# Altium schematic sheet STM32_Plate.SchDoc
size A4; PageSetup: Record=PageOptions|CenterHorizontal=True|CenterVertical=True|PrintScale=1.00|XCorrection=1.00|YCorrection=1.00|PrintKind=1|BorderSize=5000000|LeftOffset=0|BottomOffset=0|Orientation=2|PaperLength=1000|PaperWidth=1000|Scale=100|PaperSource=7|PrintQuality=-3|MediaType=1|DitherType=10|PrintScaleMode=1|PaperKind=A4|PaperIndex=9
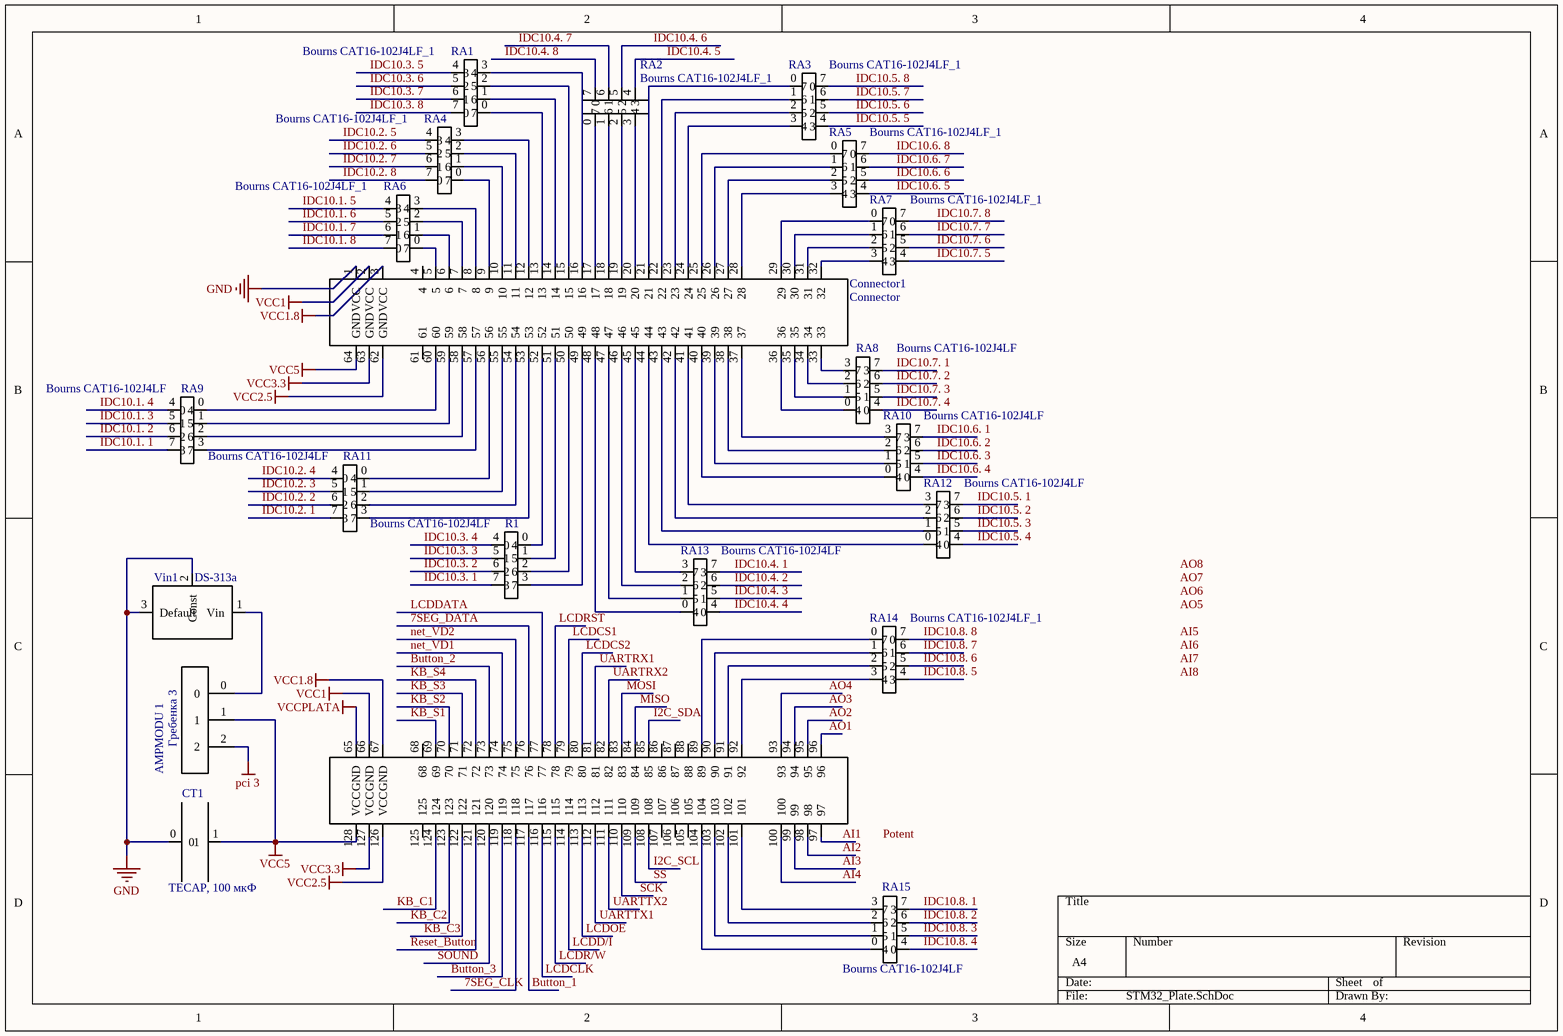
[diagram p0: STM32_Plate.SchDoc]

## Parts
AMPMODU_1  Гребенка 3  [AMPMODU 826629-3]
Connector1  Connector  [Connect]
CT1  TECAP, 100 мкФ  [tantal cap]
R1  Bourns CAT16-102J4LF  [CAT16-102J4LF]
RA1  Bourns CAT16-102J4LF_1  [CAT16-102J4LF_2]
RA2  Bourns CAT16-102J4LF_1  [CAT16-102J4LF_2]
RA3  Bourns CAT16-102J4LF_1  [CAT16-102J4LF_2]
RA4  Bourns CAT16-102J4LF_1  [CAT16-102J4LF_2]
RA5  Bourns CAT16-102J4LF_1  [CAT16-102J4LF_2]
RA6  Bourns CAT16-102J4LF_1  [CAT16-102J4LF_2]
RA7  Bourns CAT16-102J4LF_1  [CAT16-102J4LF_2]
RA8  Bourns CAT16-102J4LF  [CAT16-102J4LF]
RA9  Bourns CAT16-102J4LF  [CAT16-102J4LF]
RA10  Bourns CAT16-102J4LF  [CAT16-102J4LF]
RA11  Bourns CAT16-102J4LF  [CAT16-102J4LF]
RA12  Bourns CAT16-102J4LF  [CAT16-102J4LF]
RA13  Bourns CAT16-102J4LF  [CAT16-102J4LF]
RA14  Bourns CAT16-102J4LF_1  [CAT16-102J4LF_2]
RA15  Bourns CAT16-102J4LF  [CAT16-102J4LF]
Vin1  DS-313a  [ds-313]

## Nets
GND: Connector1.1(VCC) CT1.0 Vin1.2(Const) Vin1.3(Default)
pci 3: AMPMODU_1.2
VCC1: Connector1.2(VCC) Connector1.66(GND)
VCC1.8: Connector1.3(VCC) Connector1.67(GND)
VCC2.5: Connector1.62(GND) Connector1.126(VCC)
VCC3.3: Connector1.63(GND) Connector1.127(VCC)
VCC5: AMPMODU_1.1 Connector1.64(GND) Connector1.128(VCC) CT1.1
VCCPLATA: Connector1.65(GND)
7SEG_CLK: Connector1.118
7SEG_DATA: Connector1.76
AI1: Connector1.97
AI2: Connector1.98
AI3: Connector1.99
AI4: Connector1.100
AO1: Connector1.96
AO2: Connector1.95
AO3: Connector1.94
AO4: Connector1.93
Button_1: Connector1.117
Button_2: Connector1.73
Button_3: Connector1.119
I2C_SCL: Connector1.108
I2C_SDA: Connector1.85
IDC10.1. 1: RA9.7
IDC10.1. 2: RA9.6
IDC10.1. 3: RA9.5
IDC10.1. 4: RA9.4
IDC10.1. 5: RA6.4
IDC10.1. 6: RA6.5
IDC10.1. 7: RA6.6
IDC10.1. 8: RA6.7
IDC10.2. 1: RA11.7
IDC10.2. 2: RA11.6
IDC10.2. 3: RA11.5
IDC10.2. 4: RA11.4
IDC10.2. 5: RA4.4
IDC10.2. 6: RA4.5
IDC10.2. 7: RA4.6
IDC10.2. 8: RA4.7
IDC10.3. 1: R1.7
IDC10.3. 2: R1.6
IDC10.3. 3: R1.5
IDC10.3. 4: R1.4
IDC10.3. 5: RA1.4
IDC10.3. 6: RA1.5
IDC10.3. 7: RA1.6
IDC10.3. 8: RA1.7
IDC10.4. 1: RA13.7
IDC10.4. 2: RA13.6
IDC10.4. 3: RA13.5
IDC10.4. 4: RA13.4
IDC10.4. 5: RA2.4
IDC10.4. 6: RA2.5
IDC10.4. 7: RA2.6
IDC10.4. 8: RA2.7
IDC10.5. 1: RA12.7
IDC10.5. 2: RA12.6
IDC10.5. 3: RA12.5
IDC10.5. 4: RA12.4
IDC10.5. 5: RA3.4
IDC10.5. 6: RA3.5
IDC10.5. 7: RA3.6
IDC10.5. 8: RA3.7
IDC10.6. 1: RA10.7
IDC10.6. 2: RA10.6
IDC10.6. 3: RA10.5
IDC10.6. 4: RA10.4
IDC10.6. 5: RA5.4
IDC10.6. 6: RA5.5
IDC10.6. 7: RA5.6
IDC10.6. 8: RA5.7
IDC10.7. 1: RA8.7
IDC10.7. 2: RA8.6
IDC10.7. 3: RA8.5
IDC10.7. 4: RA8.4
IDC10.7. 5: RA7.4
IDC10.7. 6: RA7.5
IDC10.7. 7: RA7.6
IDC10.7. 8: RA7.7
IDC10.8. 1: RA15.7
IDC10.8. 2: RA15.6
IDC10.8. 3: RA15.5
IDC10.8. 4: RA15.4
IDC10.8. 5: RA14.4
IDC10.8. 6: RA14.5
IDC10.8. 7: RA14.6
IDC10.8. 8: RA14.7
KB_C1: Connector1.124
KB_C2: Connector1.123
KB_C3: Connector1.122
KB_S1: Connector1.69
KB_S2: Connector1.70
KB_S3: Connector1.71
KB_S4: Connector1.72
LCDCLK: Connector1.116
LCDCS1: Connector1.79
LCDCS2: Connector1.80
LCDD/I: Connector1.114
LCDDATA: Connector1.77
LCDOE: Connector1.113
LCDR/W: Connector1.115
LCDRST: Connector1.78
MISO: Connector1.84
MOSI: Connector1.83
net_VD1: Connector1.74
net_VD2: Connector1.75
Reset_Button: Connector1.121
SCK: Connector1.110
SOUND: Connector1.120
SS: Connector1.109
UARTRX1: Connector1.81
UARTRX2: Connector1.82
UARTTX1: Connector1.112
UARTTX2: Connector1.111
NetAMPMODU_1_0: AMPMODU_1.0 Vin1.1(Vin)
NetConnector1_5: Connector1.5 RA6.0
NetConnector1_6: Connector1.6 RA6.1
NetConnector1_7: Connector1.7 RA6.2
NetConnector1_8: Connector1.8 RA6.3
NetConnector1_9: Connector1.9 RA4.0
NetConnector1_10: Connector1.10 RA4.1
NetConnector1_11: Connector1.11 RA4.2
NetConnector1_12: Connector1.12 RA4.3
NetConnector1_13: Connector1.13 RA1.0
NetConnector1_14: Connector1.14 RA1.1
NetConnector1_15: Connector1.15 RA1.2
NetConnector1_16: Connector1.16 RA1.3
NetConnector1_17: Connector1.17 RA2.0
NetConnector1_18: Connector1.18 RA2.1
NetConnector1_19: Connector1.19 RA2.2
NetConnector1_20: Connector1.20 RA2.3
NetConnector1_21: Connector1.21 RA3.0
NetConnector1_22: Connector1.22 RA3.1
NetConnector1_23: Connector1.23 RA3.2
NetConnector1_24: Connector1.24 RA3.3
NetConnector1_25: Connector1.25 RA5.0
NetConnector1_26: Connector1.26 RA5.1
NetConnector1_27: Connector1.27 RA5.2
NetConnector1_28: Connector1.28 RA5.3
NetConnector1_29: Connector1.29 RA7.0
NetConnector1_30: Connector1.30 RA7.1
NetConnector1_31: Connector1.31 RA7.2
NetConnector1_32: Connector1.32 RA7.3
NetConnector1_33: Connector1.33 RA8.3
NetConnector1_34: Connector1.34 RA8.2
NetConnector1_35: Connector1.35 RA8.1
NetConnector1_36: Connector1.36 RA8.0
NetConnector1_37: Connector1.37 RA10.3
NetConnector1_38: Connector1.38 RA10.2
NetConnector1_39: Connector1.39 RA10.1
NetConnector1_40: Connector1.40 RA10.0
NetConnector1_41: Connector1.41 RA12.3
NetConnector1_42: Connector1.42 RA12.2
NetConnector1_43: Connector1.43 RA12.1
NetConnector1_44: Connector1.44 RA12.0
NetConnector1_45: Connector1.45 RA13.3
NetConnector1_46: Connector1.46 RA13.2
NetConnector1_47: Connector1.47 RA13.1
NetConnector1_48: Connector1.48 RA13.0
NetConnector1_49: Connector1.49 R1.3
NetConnector1_50: Connector1.50 R1.2
NetConnector1_51: Connector1.51 R1.1
NetConnector1_52: Connector1.52 R1.0
NetConnector1_53: Connector1.53 RA11.3
NetConnector1_54: Connector1.54 RA11.2
NetConnector1_55: Connector1.55 RA11.1
NetConnector1_56: Connector1.56 RA11.0
NetConnector1_57: Connector1.57 RA9.3
NetConnector1_58: Connector1.58 RA9.2
NetConnector1_59: Connector1.59 RA9.1
NetConnector1_60: Connector1.60 RA9.0
NetConnector1_89: Connector1.89 RA14.0
NetConnector1_90: Connector1.90 RA14.1
NetConnector1_91: Connector1.91 RA14.2
NetConnector1_92: Connector1.92 RA14.3
NetConnector1_101: Connector1.101 RA15.3
NetConnector1_102: Connector1.102 RA15.2
NetConnector1_103: Connector1.103 RA15.1
NetConnector1_104: Connector1.104 RA15.0

Not connected (* = marked no-connect by the designer): Connector1 4 61 68 86 87 88 105 106 107 125

## Notes on the sheet
- Labels drawn without touching a wire or pin: AI5, AI6, AI7, AI8, AO5, AO6, AO7, AO8, Potent

## Library data of the parts
AMPMODU_1 = AMPMODU 826629-3